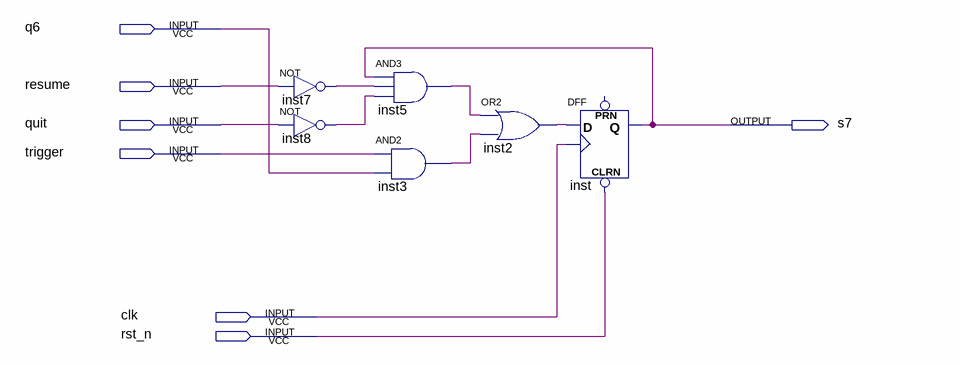
[diagram p0: schematic sheet]
// Quartus schematic s7.bdf as structural Verilog: 6 symbols, 7 pins
module s7 (
  input  q6,
  input  resume,
  input  quit,
  input  trigger,
  input  clk,
  input  rst_n,
  output s7
);

  wire inst2_out, inst3_out, inst5_out, inst7_out, inst8_out;

  not inst7 (inst7_out, resume);
  not inst8 (inst8_out, quit);
  and inst5 (inst5_out, s7, inst7_out, inst8_out);
  and inst3 (inst3_out, trigger, q6);
  or inst2 (inst2_out, inst5_out, inst3_out);
  DFF inst (.CLRN(rst_n), .CLK(clk), .D(inst2_out), .Q(s7));  // open: PRN
endmodule
